# EAGLE design DAC-PCB V2 (2) (EAGLE 7.7.0)
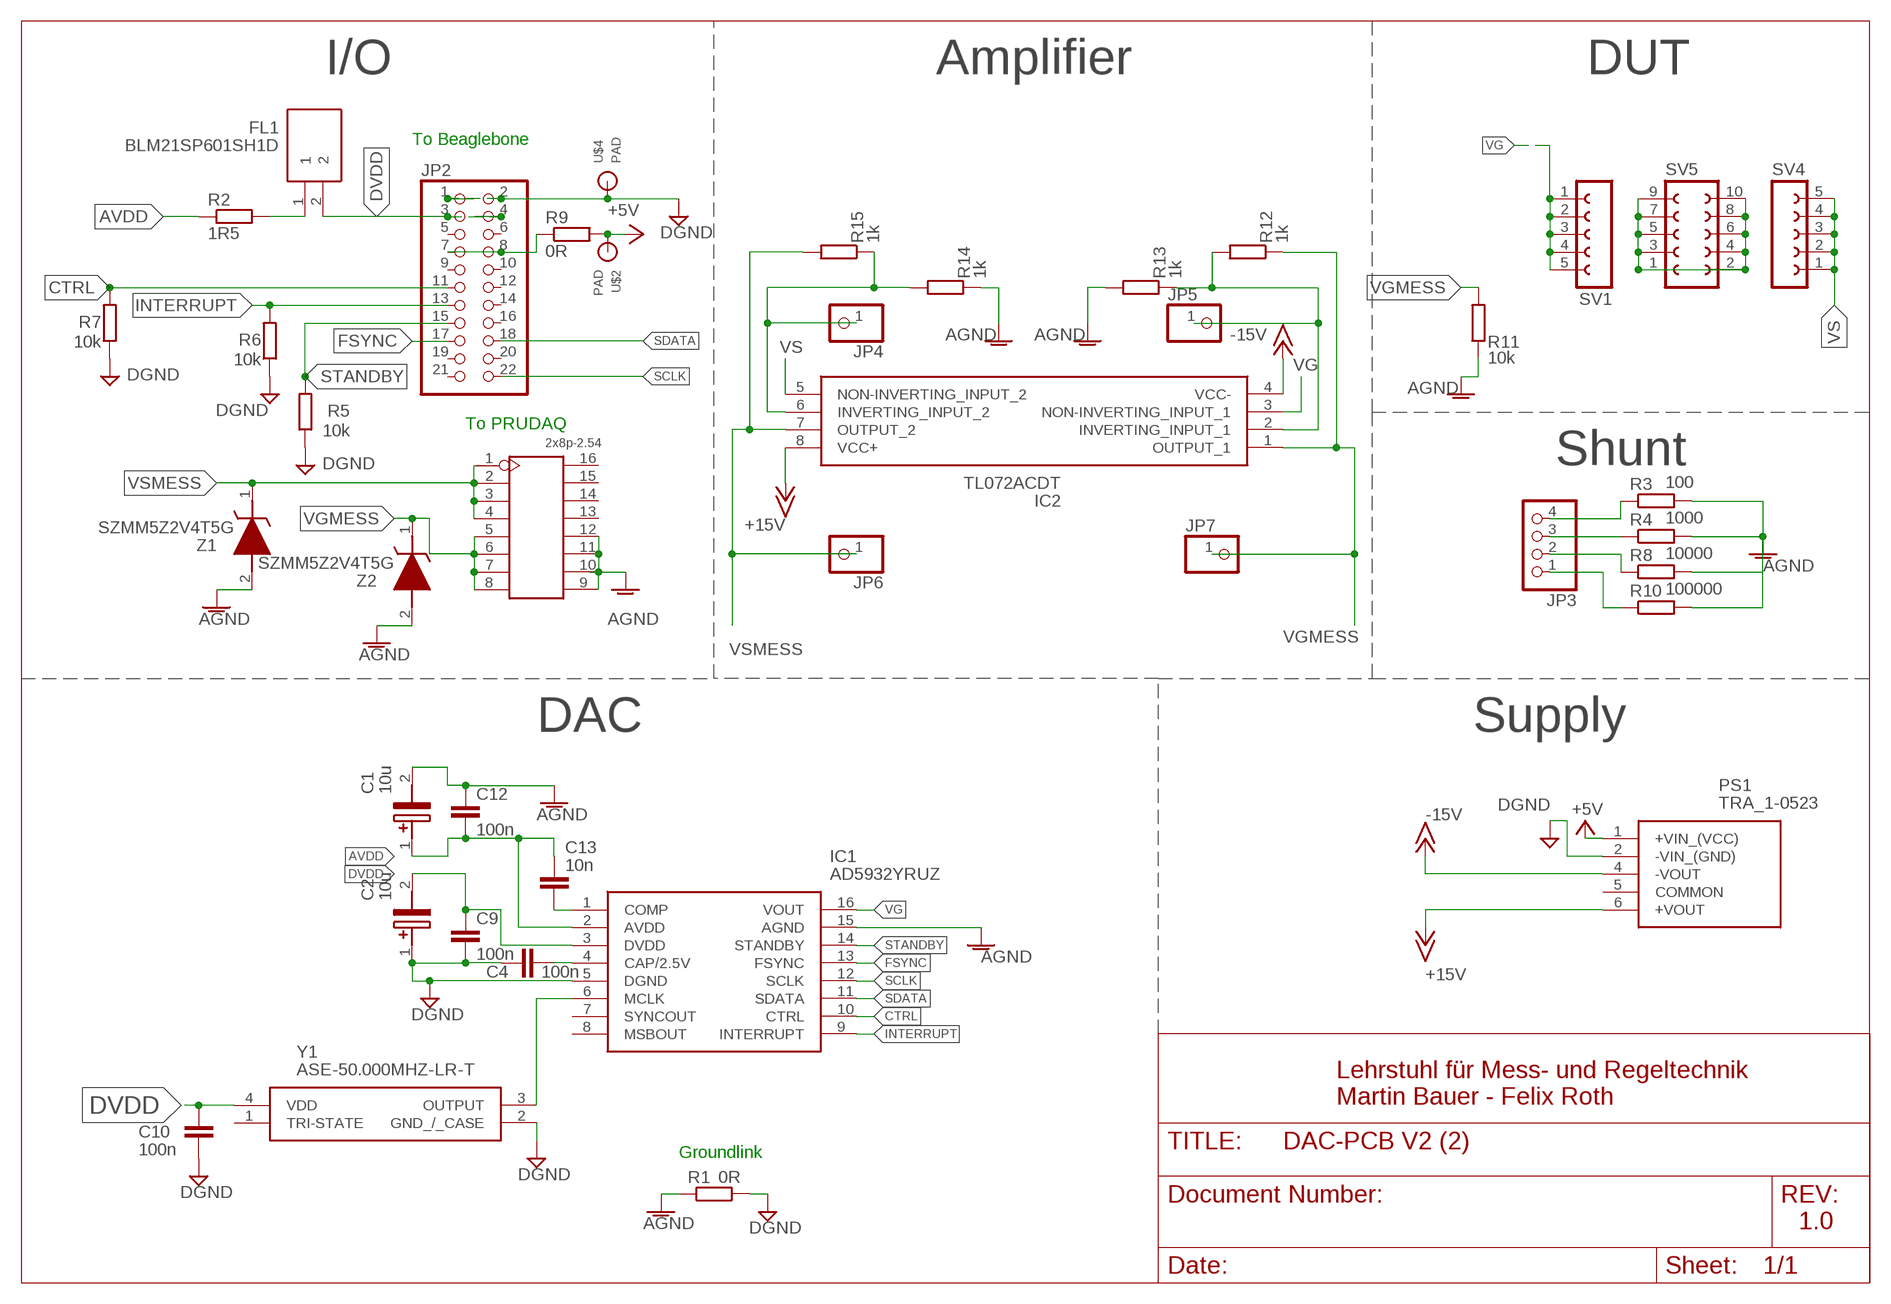
[diagram p0: schematic, sheet 1]

## Parts
C1  10u  865080340001  [CAPAE430X550N]
C2  10u  865080340001  [CAPAE430X550N]
C4  100n  C-EUC0805  [C0805]
C9  100n  C-EUC0805  [C0805]
C10  100n  C-EUC0805  [C0805]
C12  100n  C-EUC0805  [C0805]
C13  10n  C-EUC0805  [C0805]
FL1  BLM21SP601SH1D  [BLM21AG102BH1J]
IC1  AD5932YRUZ  [SOP65P640X120-16N]
IC2  TL072ACDT  [SOIC127P600X175-8N]
J2  2x8p-2.54  DIP-BLACK-FEMALE-HEADER-VERT(2X8P-2.54)  [H2X8-2.54]
JP2  PINHD-2X11  [2X11]
JP3  PINHD-1X4  [1X04]
JP4  PINHD-1X1  [1X01]
JP5  PINHD-1X1  [1X01]
JP6  PINHD-1X1  [1X01]
JP7  PINHD-1X1  [1X01]
PS1  TRA_1-0523  [TRA_1-2423]
R1  0R  R-EU_R1210  [R1210]
R2  1R5  R-EU_R0805  [R0805]
R3  100  R-EU_R0805  [R0805]
R4  1000  R-EU_R0805  [R0805]
R5  10k  R-EU_R0805  [R0805]
R6  10k  R-EU_R0805  [R0805]
R7  10k  R-EU_R0805  [R0805]
R8  10000  R-EU_R0805  [R0805]
R9  0R  R-EU_R0805  [R0805]
R10  100000  R-EU_R0805  [R0805]
R11  10k  R-EU_R0805  [R0805]
R12  1k  R-EU_R0805  [R0805]
R13  1k  R-EU_R0805  [R0805]
R14  1k  R-EU_R0805  [R0805]
R15  1k  R-EU_R0805  [R0805]
SV1  FE05-1  [FE05-1]
SV4  FE05-1  [FE05-1]
SV5  FE05-2  [FE05-2]
U$2  PAD  [PAD_PROTO]
U$4  PAD  [PAD_PROTO]
Y1  ASE-50.000MHZ-LR-T  [ASE24576MHZLCT]
Z1  SZMM5Z2V4T5G  [SZMM5Z2V4T5G]
Z2  SZMM5Z2V4T5G  [SZMM5Z2V4T5G]

## Nets
+5V: PS1.1(+VIN_(VCC)) R9.2 U$2.1(S)
+15V: IC2.8(VCC+) PS1.6(+VOUT)
-15V: IC2.4(VCC-) PS1.4(-VOUT)
AGND: C1.2(-) C12.1 IC1.15(AGND) J2.9 J2.10 J2.11 J2.12 R1.1 R3.2 R4.2 R8.2 R10.2 R11.1 R13.2 R14.1 Z1.2(A) Z2.2(A)
AVDD: C1.1(+) C12.2 C13.1 IC1.2(AVDD) R2.1
CTRL: IC1.10(CTRL) JP2.11 R7.2
DGND: C2.1(+) C4.1 C9.2 C10.2 IC1.5(DGND) JP2.1 JP2.2 PS1.2(-VIN_(GND)) R1.2 R5.1 R6.1 R7.1 U$4.1(S) Y1.2(GND_/_CASE)
DVDD: C2.2(-) C9.1 C10.1 FL1.2 IC1.3(DVDD) JP2.3 JP2.4 Y1.4(VDD)
FSYNC: IC1.13(FSYNC) JP2.17
INTERRUPT: IC1.9(INTERRUPT) JP2.13 R6.2
N$1: JP3.4 R3.1
N$2: JP3.3 R4.1
N$3: C4.2 IC1.4(CAP/2.5V)
N$4: FL1.1 R2.2
N$5: IC1.6(MCLK) Y1.3(OUTPUT)
N$6: IC2.6(INVERTING_INPUT_2) JP4.1 R14.2 R15.1
N$7: C13.2 IC1.1(COMP)
N$8: JP2.7 JP2.8 R9.1
N$9: JP3.2 R8.1
N$10: JP3.1 R10.1
N$11: IC2.2(INVERTING_INPUT_1) JP5.1 R12.2 R13.1
N$12: SV5.1 SV5.2 SV5.3 SV5.4 SV5.5 SV5.6 SV5.7 SV5.8 SV5.9 SV5.10
SCLK: IC1.12(SCLK) JP2.22
SDATA: IC1.11(SDATA) JP2.18
STANDBY: IC1.14(STANDBY) JP2.15 R5.2
VG: IC1.16(VOUT) IC2.3(NON-INVERTING_INPUT_1) SV1.1 SV1.2 SV1.3 SV1.4 SV1.5
VGMESS: IC2.1(OUTPUT_1) J2.5 J2.6 J2.7 J2.8 JP7.1 R11.2 R12.1 Z2.1(K)
VS: IC2.5(NON-INVERTING_INPUT_2) SV4.1 SV4.2 SV4.3 SV4.4 SV4.5
VSMESS: IC2.7(OUTPUT_2) J2.1 J2.2 J2.3 J2.4 JP6.1 R15.2 Z1.1(K)
Unconnected: IC1.7(SYNCOUT) IC1.8(MSBOUT) J2.13 J2.14 J2.15 J2.16 JP2.5 JP2.6 JP2.9 JP2.10 JP2.12 JP2.14 JP2.16 JP2.19 JP2.20 JP2.21 PS1.5(COMMON) Y1.1(TRI-STATE)

## Notes on the sheet
- I/O | Amplifier | DUT
- To Beaglebone
- To PRUDAQ
- Shunt
- DAC | Supply
- Lehrstuhl für Mess- und Regeltechnik
  Martin Bauer - Felix Roth
- Groundlink
- 1.0

## Library data of the parts
C1 C2 = SamacSys_Parts:865080340001: Wurth Elektronik 10uF 16 V dc Aluminium Electrolytic Capacitor, WCAP-ASLI Series 2000h 4 (Dia.) x 5.35mm Source: Datasheet <https://componentsearchengine.com/Datasheets/1/865080340001.pdf>; DESCRIPTION: Wurth Elektronik 10uF 16 V dc Aluminium Electrolytic Capacitor, WCAP-ASLI Series 2000h 4 (Dia.) x 5.35mm; HEIGHT: 5.5mm; MANUFACTURER_NAME: Wurth Elektronik; MANUFACTURER_PART_NUMBER: 865080340001; MOUSER_PART_NUMBER: 710-865080340001; MOUSER_PRICE-STOCK: https://www.mouser.co.uk/ProductDetail/Wurth-Elektronik/865080340001?qs=0KOYDY2FL2%252BaqRFD837lAw%3D%3D
C4 C9 C10 C12 C13 = rcl:C-EU: CAPACITOR, European symbol; SPICEPREFIX: C
FL1 = SamacSys_Parts:BLM21SP601SH1D: BLM21_H1D Series EMI Suppression Filter 600+/-25% at 100MHz 2.3A @85 Source: Datasheet <https://www.murata.com/en-us/products/productdetail?partno=BLM21SP601SH1#>; DESCRIPTION: BLM21_H1D Series EMI Suppression Filter 600+/-25% at 100MHz 2.3A @85; HEIGHT: 1.05mm; MANUFACTURER_NAME: Murata Electronics; MANUFACTURER_PART_NUMBER: BLM21SP601SH1D; MOUSER_PART_NUMBER: 81-BLM21SP601SH1D; MOUSER_PRICE-STOCK: https://www.mouser.co.uk/ProductDetail/Murata-Electronics/BLM21SP601SH1D/?qs=17u8i%2FzlE89O6NnGGVLYAA%3D%3D
IC1 = SamacSys_Parts:AD5932YRUZ: AD5932YRUZ, Function Generator, 16-Pin TSSOP Source: Datasheet <http://www.analog.com/static/imported-files/data_sheets/AD5932.pdf>; DESCRIPTION: AD5932YRUZ, Function Generator, 16-Pin TSSOP; HEIGHT: 1.2mm; MANUFACTURER_NAME: Analog Devices; MANUFACTURER_PART_NUMBER: AD5932YRUZ; MOUSER_PART_NUMBER: 584-AD5932YRUZ; MOUSER_PRICE-STOCK: https://www.mouser.co.uk/ProductDetail/Analog-Devices/AD5932YRUZ?qs=NmRFExCfTkGD8ATmZ56Lsg%3D%3D
IC2 = SamacSys_Parts:TL072ACDT: JFET inputs, low input bias current Source: Datasheet <https://www.st.com/resource/en/datasheet/tl072.pdf>; DESCRIPTION: JFET inputs, low input bias current; HEIGHT: 1.75mm; MANUFACTURER_NAME: STMicroelectronics; MANUFACTURER_PART_NUMBER: TL072ACDT; MOUSER_PART_NUMBER: 511-TL072ACDT; MOUSER_PRICE-STOCK: https://www.mouser.co.uk/ProductDetail/STMicroelectronics/TL072ACDT?qs=YOAEcAN%252BEecOpcGlIX1OYw%3D%3D
J2 = Seeed-OPL-Connector:DIP-BLACK-FEMALE-HEADER-VERT(2X8P-2.54): 320030080; MPN: F185-1216A0BSYA1
JP2 = pinhead:PINHD-2X11: PIN HEADER
JP3 = pinhead:PINHD-1X4: PIN HEADER
JP4-JP7 = pinhead:PINHD-1X1: PIN HEADER
PS1 = SamacSys_Parts:TRA_1-0523: 1 Watt DC/DC converter, industrial, +/-10% input, semi-regulated, 1500 VDC I/O-siolation, encapsulated, SIP-7 package Source: Datasheet <https://componentsearchengine.com/Datasheets/1/TRA 1-0523.pdf>; DESCRIPTION: 1 Watt DC/DC converter, industrial, +/-10% input, semi-regulated, 1500 VDC I/O-siolation, encapsulated, SIP-7 package; HEIGHT: mm; MANUFACTURER_NAME: Traco Power; MANUFACTURER_PART_NUMBER: TRA 1-0523; MOUSER_PART_NUMBER: 495-TRA1-0523; MOUSER_PRICE-STOCK: https://www.mouser.com/Search/Refine.aspx?Keyword=495-TRA1-0523
R1-R15 = rcl:R-EU_: RESISTOR, European symbol
SV1 SV4 = con-lsta:FE05-1: FEMALE HEADER; OC_FARNELL: unknown; OC_NEWARK: unknown
SV5 = con-lsta:FE05-2: FEMALE HEADER; OC_FARNELL: unknown; OC_NEWARK: unknown
U$2 U$4 = BauteileTjMonitor:PAD
Y1 = SamacSys_Parts:ASE-50.000MHZ-LR-T: ASE-50.000MHZ-LR-T Crystal Oscillator, 50 MHz, +/-25ppm CMOS 15pF, 4-Pin SMD, 3.2 x 2.5 x 1.2mm Source: Datasheet; DESCRIPTION: ASE-50.000MHZ-LR-T Crystal Oscillator, 50 MHz, +/-25ppm CMOS 15pF, 4-Pin SMD, 3.2 x 2.5 x 1.2mm; HEIGHT: 1mm; MANUFACTURER_NAME: ABRACON; MANUFACTURER_PART_NUMBER: ASE-50.000MHZ-LR-T; MOUSER_PART_NUMBER: 815-ASE50.000MHZLRT; MOUSER_PRICE-STOCK: https://www.mouser.co.uk/ProductDetail/ABRACON/ASE-50000MHZ-LR-T?qs=8%2FY3nhUUz1r1JxsGfvA4iQ%3D%3D
Z1 Z2 = SamacSys_Parts:SZMM5Z2V4T5G: Zener Diodes SOD-523 EUT SNGL PB FREE Source: Datasheet <https://componentsearchengine.com/Datasheets/1/SZMM5Z2V4T5G.pdf>; DESCRIPTION: Zener Diodes SOD-523 EUT SNGL PB FREE; HEIGHT: 0.7mm; MANUFACTURER_NAME: ON Semiconductor; MANUFACTURER_PART_NUMBER: SZMM5Z2V4T5G; MOUSER_PART_NUMBER: 863-SZMM5Z2V4T5G; MOUSER_PRICE-STOCK: https://www.mouser.co.uk/ProductDetail/ON-Semiconductor/SZMM5Z2V4T5G/?qs=byeeYqUIh0PS%252B99qVmCmbg%3D%3D

## Board
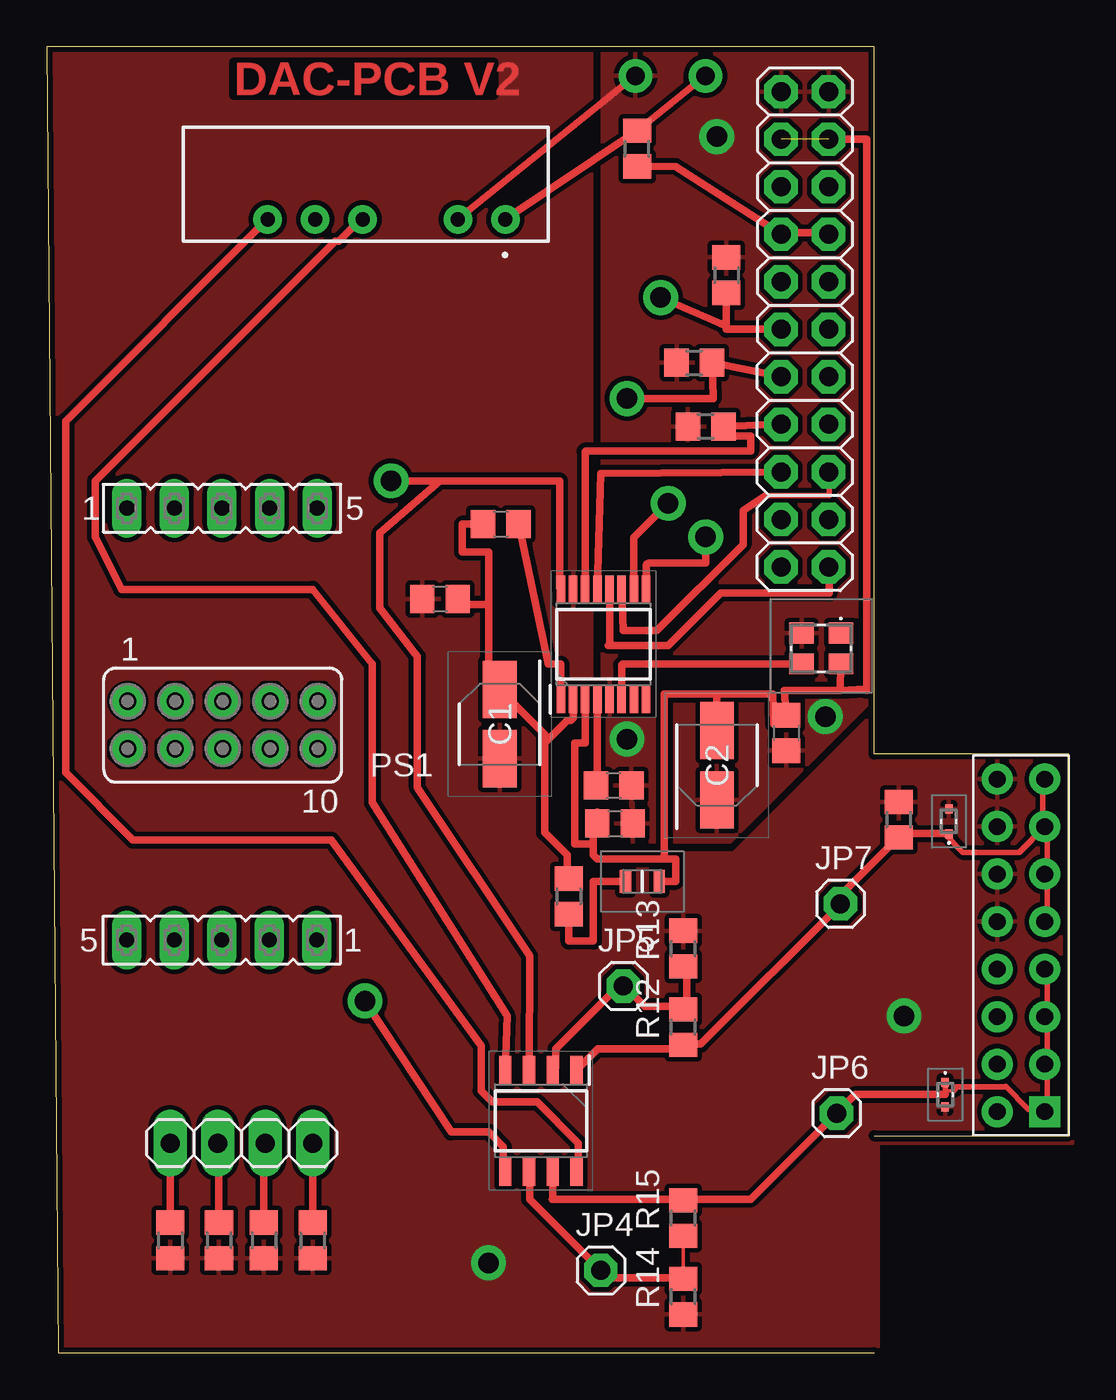
[diagram p1: board, top side]
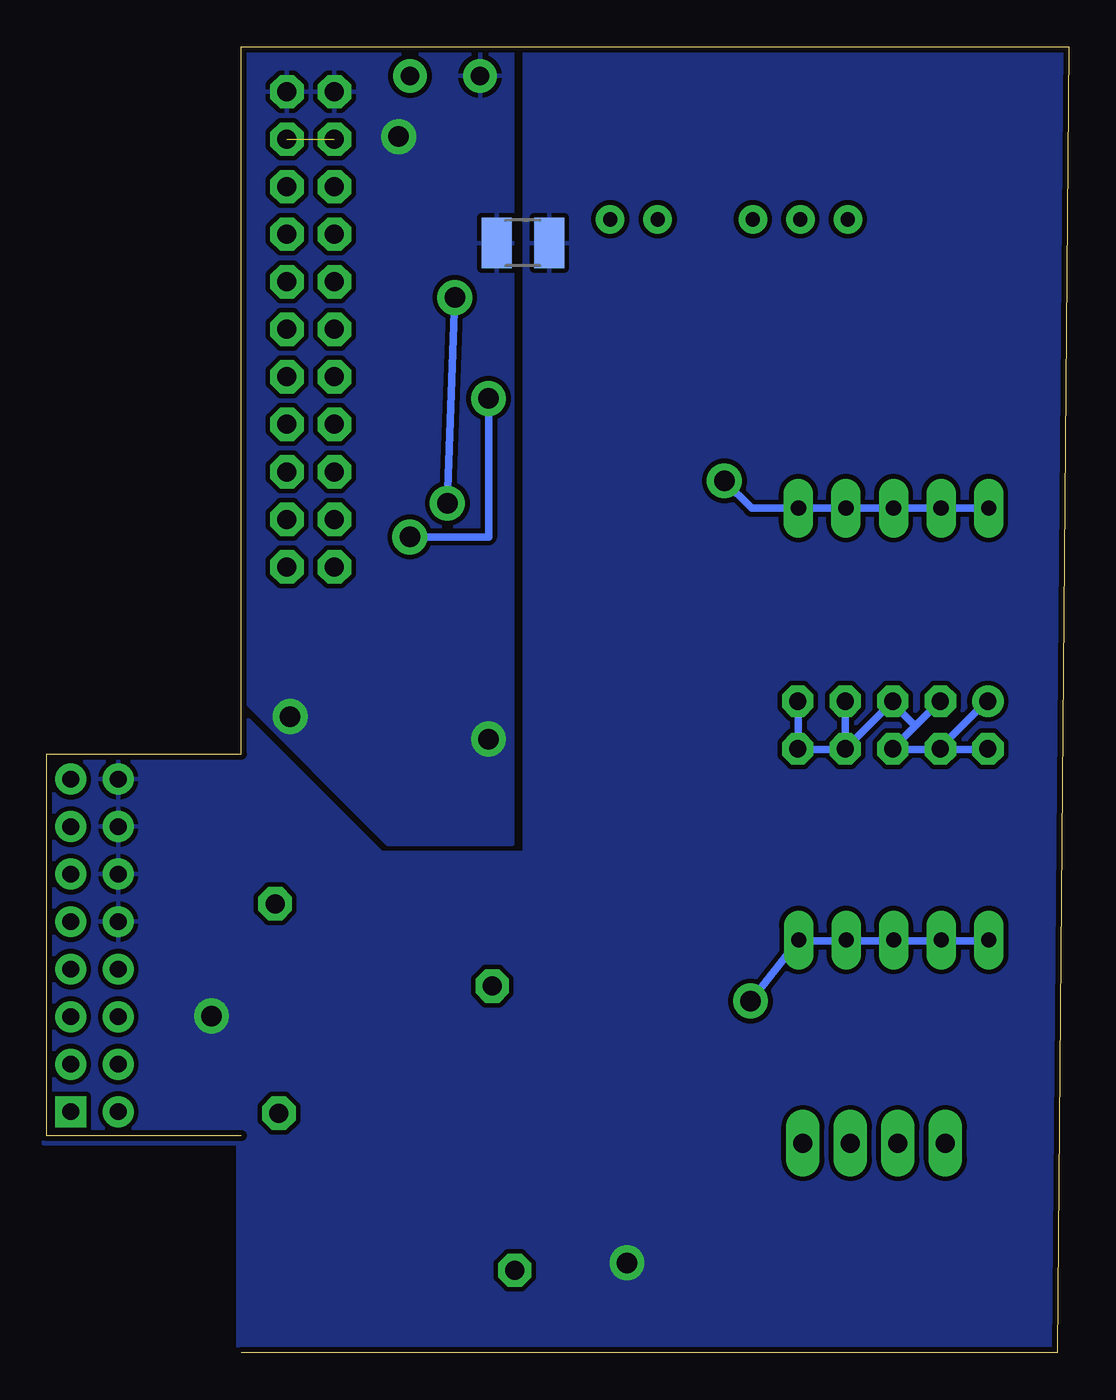
[diagram p2: board, bottom side, seen from below]

Size 54.6 x 69.8 mm. Coordinates in mm from the lower left corner, seen from the top.
Outline: 44.2,0 0.6,0 0,69.8 44.2,69.8 44.2,32 54.6,32 54.6,11.6 44.2,11.6
Copper layers (1*16): Top 0.035mm / dielectric 1.5mm / Bottom 0.035mm
Design rules "default *": minimum track width 0.2mm, minimum drill 0.5mm, track to track 0.2mm, track to pad 0.2mm, pad to pad 0.2mm, via to via 0.2mm, smd to smd 0.2mm, copper to edge 0.3mm, drill to drill 0.2mm, minimum pad ring 15mil, minimum via ring 15mil, stop-mask expansion 4mil, vias tented up to drill 0mil, thermal gap 10mil

### Footprints (pad centres in the part's own frame; a part is rotated, then mirrored left to right if it is on the bottom)
CAPAE430X550N = smd 3.05 x 1.8: 1 -1.85,0; 2 1.85,0
C0805 = smd 1.3 x 1.5: 1 -0.95,0; 2 0.95,0
BLM21AG102BH1J = smd 0.6 x 1.25: 1 -0.9,0; 2 0.9,0
SOP65P640X120-16N = smd 1.475 x 0.45: 1 -2.938,2.275; 2 -2.938,1.625; 3 -2.938,0.975; 4 -2.938,0.325; 5 -2.938,-0.325; 6 -2.938,-0.975; 7 -2.938,-1.625; 8 -2.938,-2.275; 9 2.938,-2.275; 10 2.938,-1.625; 11 2.938,-0.975; 12 2.938,-0.325; 13 2.938,0.325; 14 2.938,0.975; 15 2.938,1.625; 16 2.938,2.275
SOIC127P600X175-8N = smd 1.525 x 0.65: 1 -2.712,1.905; 2 -2.712,0.635; 3 -2.712,-0.635; 4 -2.712,-1.905; 5 2.712,-1.905; 6 2.712,-0.635; 7 2.712,0.635; 8 2.712,1.905
H2X8-2.54 = drill 0.889 pad 1.651 square: 1 -1.27,8.89 | drill 0.889 pad 1.651: 2 -1.27,6.35; 3 -1.27,3.81; 4 -1.27,1.27; 5 -1.27,-1.27; 6 -1.27,-3.81; 7 -1.27,-6.35; 8 -1.27,-8.89; 9 1.27,-8.89; 10 1.27,-6.35; 11 1.27,-3.81; 12 1.27,-1.27; 13 1.27,1.27; 14 1.27,3.81; 15 1.27,6.35; 16 1.27,8.89
2X11 = drill 1.016 octagon: 1 -12.7,-1.27; 2 -12.7,1.27; 3 -10.16,-1.27; 4 -10.16,1.27; 5 -7.62,-1.27; 6 -7.62,1.27; 7 -5.08,-1.27; 8 -5.08,1.27; 9 -2.54,-1.27; 10 -2.54,1.27; 11 0,-1.27; 12 0,1.27; 13 2.54,-1.27; 14 2.54,1.27; 15 5.08,-1.27; 16 5.08,1.27; 17 7.62,-1.27; 18 7.62,1.27; 19 10.16,-1.27; 20 10.16,1.27; 21 12.7,-1.27; 22 12.7,1.27
1X04 = drill 1.016 long: 1 -3.81,0; 2 -1.27,0; 3 1.27,0; 4 3.81,0
1X01 = drill 1.016 octagon: 1 0,0
TRA_1-2423 = drill 0.76 pad 1.26: 1 2.3,-1.175; 2 4.84,-1.175; 4 9.92,-1.175; 5 12.46,-1.175; 6 15,-1.175
R1210 = smd 1.6 x 2.7: 1 -1.4,0; 2 1.4,0
R0805 = smd 1.3 x 1.5: 1 -0.95,0; 2 0.95,0
FE05-1 = drill 0.813 long: 1 -5.08,0; 2 -2.54,0; 3 0,0; 4 2.54,0; 5 5.08,0
FE05-2 = drill 0.914: 1 -5.08,1.27 | drill 0.914 octagon: 2 -5.08,-1.27; 3 -2.54,1.27; 4 -2.54,-1.27; 5 0,1.27; 6 0,-1.27; 7 2.54,1.27; 8 2.54,-1.27; 9 5.08,1.27; 10 5.08,-1.27
PAD_PROTO = drill 1 pad 1.8: 1 0,0
ASE24576MHZLCT = smd 1.3 x 1.1: 1 -1.05,-0.825; 2 1.05,-0.825; 3 1.05,0.825; 4 -1.05,0.825
SZMM5Z2V4T5G = smd 0.48 x 0.4: 1 -0.66,0; 2 0.66,0

### Placement (x,y rotation side)
C1  24.2,33.6 270 top
C2  35.8,31.4 90 top
C4  30.29,30.31 180 top
C9  30.36,28.29 0 top
C10  39.51,33.13 270 top
C12  21.01,40.29 0 top
C13  24.26,44.29 0 top
FL1  31.82,25.19 0 top
IC1  29.74,37.87 90 top
IC2  26.4,12.4 270 top
J2  52.05,21.77 180 top
JP2  40.5,54.7 270 top
JP3  10.4,11.2 0 top
JP4  29.6,4.4 0 top
JP5  30.8,19.6 0 top
JP6  42.2,12.8 0 top
JP7  42.4,24 0 top
PS1  26.8,59.4 180 top
R1  29.16,59.31 180 bottom
R2  27.89,24.39 270 top
R3  14.2,6 270 top
R4  11.6,6 270 top
R5  35.2,49.51 0 top
R6  34.6,52.91 0 top
R7  36.31,57.6 270 top
R8  9.2,6 270 top
R9  31.54,64.36 90 top
R10  6.6,6 270 top
R11  45.51,28.49 270 top
R12  34,17.4 90 top
R13  34,21.6 90 top
R14  34,3 90 top
R15  34,7.2 90 top
SV1  9.36,45.14 0 top
SV4  9.35,22.06 180 top
SV5  9.4,33.55 0 top
U$2  35.19,68.24 0 top
U$4  31.45,68.24 0 top
Y1  41.38,37.64 180 top
Z1  48,13.8 270 top
Z2  48.2,28.4 90 top

### Tracks (layer width: path | path; a pad name or v marks a point on that pad's centre or on a via)
+5V
  Top 0.406: U$2.1 R9.2 PS1.1
+15V
  Top 0.2: 28.4,9.8 IC2.8 | 11.8,60.4 PS1.6
  Top 0.406: 28.4,9.8 28.4,11.2 26.2,13.4 23.8,13.4 23.2,14 23.2,16.4 15.2,27.4 4.6,27.4 1,31 1,49.8 11.6,60.4 11.8,60.4
-15V
  Top 0.2: 15.6,59.4 15.4,59.4 | 24.6,15.2 IC2.4 | 16.8,60.6 PS1.4
  Top 0.406: 15.4,59.4 2.6,46.6 2.6,43.6 4,40.8 14.2,40.8 17.4,36.8 17.4,29.4 24.6,18 IC2.4 | 16.8,60.6 15.6,59.4
AGND  (via drill 1.1)
  other vias: 45.8,18 23.6,4.8
  pour Top (isolate 0.254): 0,70 29.1,70 29.1,26.7 36.7,26.7 44.4,34.4 44.4,32.4 54.8,32.4 54.8,11.2 44.4,11.2 44.4,0 0.6,0
  pour Bottom (isolate 0.254): 0,70 29.1,70 29.1,26.7 36.7,26.7 44.4,34.4 44.4,32.4 54.8,32.4 54.8,11.2 44.4,11.2 44.4,0 0.6,0
AVDD
  Top 0.406: R2.1 27.8,25.43 27.8,26.6 26.6,27.8 26.6,32.6 | 26.6,32.6 27.8,33.8 28,33.8 28.11,33.91 IC1.2 | 23.6,40 23.6,36.05 arc90 C1.1 26.6,33.05 26.6,32.6 | 23.6,40 22.25,40 arc-90 C12.2 | C13.1 22.2,44.29 22.2,42.8 23.6,42.8 23.6,40
CTRL  (via drill 1.1)
  Top 0.406: JP2.11 36.31,54.7 | 36.31,54.7 R7.2 | 36.31,54.7 arc90 36.01,55 v32.8,56.4 | v33.2,45.4 31.36,43.56 IC1.10
  Bottom 0.406: v32.8,56.4 v33.2,45.4
DGND  (via drill 1.1)
  Top 0.406: PS1.2 U$4.1
  other vias: 35.8,65 41.6,34 31,32.8
  pour Bottom (isolate 0.254): 29.7,27.2 29.7,70 44.4,70 44.4,35.2 36.4,27.2
  pour Top (isolate 0.254): 29.7,70 44.3,70 44.3,35.1 36.5,27.3 29.7,27.3
DVDD  (1 unrouted)
  Top 0.406: JP2.4 43.8,64.86 43.8,35.4 43.71,35.49 42.4,35.4 | FL1.2 33.6,25.19 33.6,26.4 33,26.4 | 33,26.4 29.41,26.4 29.2,26.61 29.2,27.2 | 29.4,28.89 C9.1 29.2,28.08 29.2,27.2 | IC1.3 28.76,32.6 28.2,32.6 28.2,27.2 29.2,27.2 | 33,26.4 33,35.2 35.8,35.2 | 35.8,35.2 C2.2 | Y1.4 42.4,35.4 | 42.4,35.4 39.4,35.4 C10.1 38.83,33.6 38.8,35.2 35.8,35.2
FSYNC
  Top 0.406: JP2.17 29.6,47 IC1.13
INTERRUPT  (via drill 1.1)
  Top 0.406: JP2.13 R6.2 35.6,51 v31,51 | v35.2,43.6 35.2,42.2 32.2,42.2 arc90 32.02,42.02 IC1.9
  Bottom 0.406: v31,51 31,43.6 v35.2,43.6
N$1
  Top 0.406: JP3.4 R3.1
N$2
  Top 0.406: JP3.3 11.6,11.2 R4.1
N$3
  Top 0.406: C4.2 29.42,31.23 IC1.4
N$4
  Top 0.406: FL1.1 29.2,25.19 29.2,22 27.89,22 R2.2
N$5
  Top 0.406: Y1.3 arc-90 40.31,36.8 30.8,36.8 arc90 30.71,36.72 IC1.6
N$6
  Top 0.2: 25.95,9.5 IC2.6 25.8,9.6 | 29.45,4.5 JP4.1 | 33.95,4 R14.2 34,4 R15.1 | 29.7,4.25 JP4.1 | 30,4 JP4.1
  Top 0.406: 29.7,4.25 29.95,4 | 25.8,9.6 25.8,8.2 JP4.1 | 30,4 34,4
N$7
  Top 0.406: C13.2 26.8,36.8 27.46,36.8 IC1.1
N$8
  Top 0.406: JP2.8 41.7,59.88 39.33,59.88 JP2.7 33.6,63.4 R9.1
N$9
  Top 0.406: JP3.2 9.2,11.2 R8.1
N$10
  Top 0.406: JP3.1 R10.1
N$11
  Top 0.2: 34.2,18.5 R12.2 33.95,18.5 | 34.2,20.5 R13.1 | 27.2,15.25 IC2.2 | 30.7,19.75 JP5.1 30.95,19.5
  Top 0.406: 34.2,20.5 34.2,18.5 | 27.2,15.25 27.2,16.25 30.7,19.75 | 33.95,18.5 31.95,18.5 30.95,19.5
N$12
  Bottom 0.406: SV5.2 4.45,32.25 6.7,32.25 SV5.4 | SV5.4 6.95,32.25 9.2,32.25 SV5.6 9.2,32.5 8.2,33.5 | SV5.1 4.45,34.75 6.7,32.5 SV5.4 | 8.2,33.5 6.95,34.75 SV5.3 | SV5.9 14.45,34.75 14.45,32.5 SV5.10 14.45,32.25 11.95,32.25 SV5.8 | SV5.8 11.95,32.5 11.95,34.75 SV5.7 | 9.45,34.75 11.7,32.5 SV5.8 | 9.45,34.75 8.2,33.5 | 9.45,34.75 SV5.5
SCLK
  Top 0.406: JP2.22 41.8,42 41.8,40.6 36,40.6 33.2,37.8 30,37.8 30.07,37.87 IC1.12
SDATA
  Top 0.254: JP2.18 41.8,47.05
  Top 0.305: 41.8,47.05 41.8,45.8 38.4,45.8
  Top 0.406: 38.4,45.8 37.2,45 37.2,43.2 32.6,38.6 30.8,38.6 IC1.11
STANDBY
  Top 0.406: JP2.15 R5.2 36.66,49 37.6,49 37.6,48.2 28.8,48.2 28.76,48.16 IC1.14
VG  (via drill 1.1)
  Top 0.406: IC1.16 27.4,40.87 27.4,46.6 21,46.6 | 21,46.6 v18.4,46.6 | IC2.3 25.8,21.2 19.8,30.2 19.8,37.2 17.8,39.8 17.8,43.8 21,46.6
  Bottom 0.406: v18.4,46.6 16.94,45.14 SV1.5 SV1.4 SV1.3 SV1.2 SV1.1
VGMESS
  Top 0.2: 53.45,23.25 J2.5 | 53.45,25.5 J2.6 | 53.2,28.25 J2.7 | 53.2,30.5 J2.8 | 33.95,16.25 R12.1 | 28.45,15.25 IC2.1 | Z2.1 | 42.45,24 JP7.1
  Top 0.305: 53.45,25.5 53.45,23.25 | 53.2,30.5 53.2,28.25 | J2.6 53.45,25.75 53.45,28 J2.7 51.95,26.75 48.95,26.75 47.95,27.75
  Top 0.406: 33.95,16.25 29.45,16.25 28.45,15.25 | Z2.1 47.95,27.75 45.7,27.75 R11.2 45.45,27.5 42.45,24.5 42.45,24 34.95,16.5 34.2,16.5 R12.1
VS  (via drill 1.1)
  Top 0.406: IC2.5 24.4,9.78 24.4,11 23.6,11.8 21.6,11.8 v17,18.8
  Bottom 0.2: 4.45,22 SV4.5 | 6.7,22 SV4.4 6.95,22 | 9.2,22 SV4.3 9.45,22
  Bottom 0.406: 6.7,22 4.45,22 | 6.95,22 9.2,22 | 9.45,22 11.7,22 SV4.2 11.95,22 14.2,22 SV4.1 v17,18.8
VSMESS
  Top 0.2: 53.45,13 J2.1 | 53.45,15.25 J2.2 53.45,15.5 | 53.45,18 J2.3 53.45,17.75 | 47.95,13.75 Z1.1 47.95,14 48.45,14 | 34.2,8.25 R15.2 34,8.2 | 42.2,12.75 JP6.1 | 27.2,9.25 27.2,9.5 IC2.7 27.2,9.2 | 51.2,14.25 51.23,14.23 51.2,14.2 | 48.7,14.25 48.62,14.18 48.6,14.2
  Top 0.305: 53.45,15.25 53.45,13 | 53.45,18 53.45,20.5 J2.4 | 53.45,17.75 53.45,15.5 | 51.23,14.23 52.45,13 53.2,13 J2.1 | 48.45,14 48.62,14.18 | 51.2,14.2 48.6,14.2 | 48,13.8 Z1.1
  Top 0.406: 33.95,8 R15.2 34.2,8.2 37.6,8.2 JP6.1 43.2,13.8 48,13.8 | 34,8.2 27,8.2 27.04,8.23 IC2.7

### Text on the board
Top: DAC-PCB V2